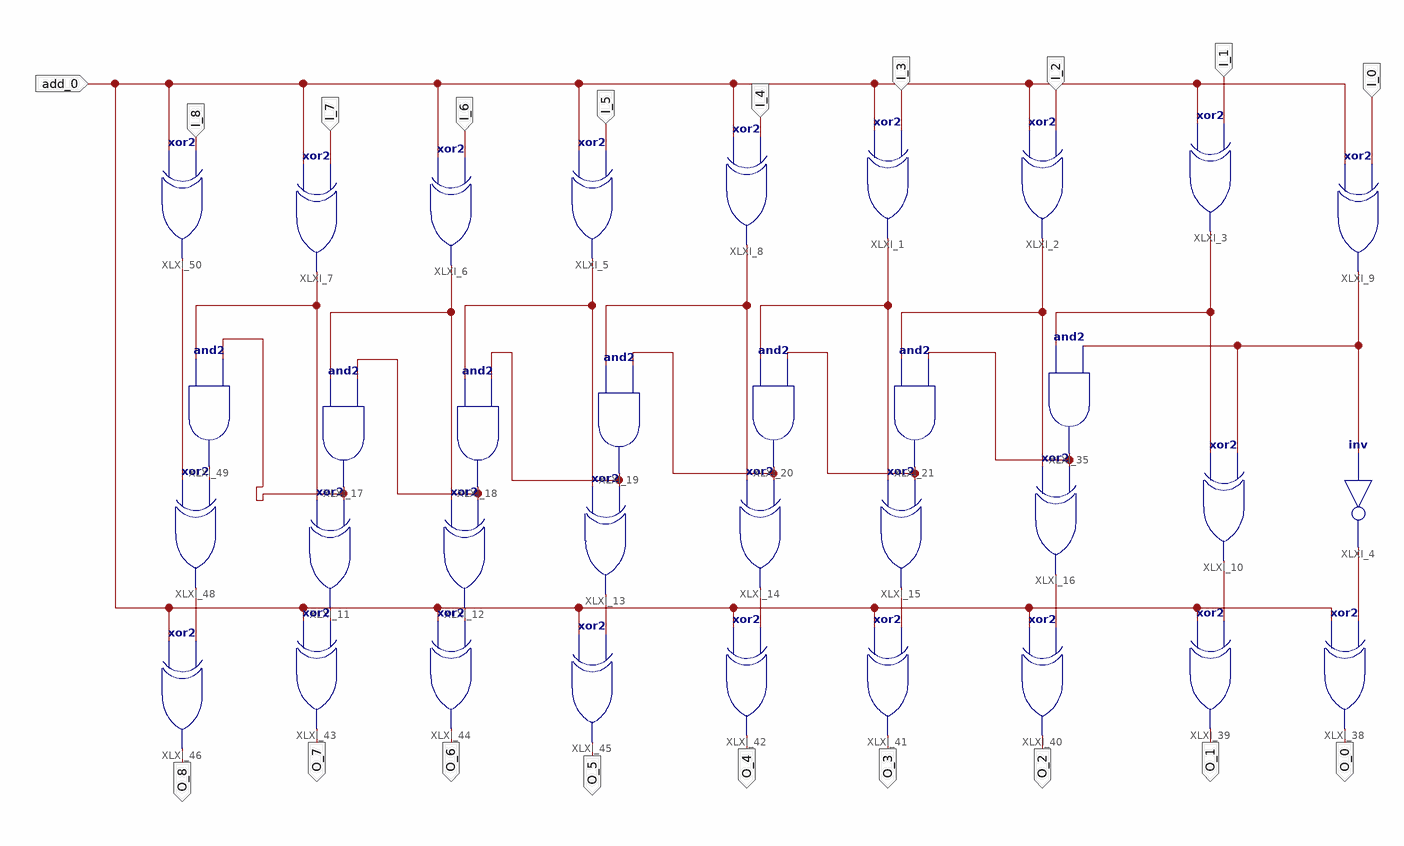
[diagram p0: schematic sheet 1]
// Xilinx ISE schematic Incrementer_Decrementer.sch (spartan3e) as structural Verilog: 34 symbols, 19 ports
module Incrementer_Decrementer (
  input  add_0,
  input  I_7,
  input  I_6,
  input  I_5,
  input  I_4,
  input  I_3,
  input  I_2,
  input  I_1,
  input  I_0,
  input  I_8,
  output O_7,
  output O_6,
  output O_5,
  output O_4,
  output O_3,
  output O_2,
  output O_1,
  output O_0,
  output O_8
);

  wire XLXN_1, XLXN_2, XLXN_3, XLXN_4, XLXN_5, XLXN_46, XLXN_47, XLXN_48, XLXN_52, XLXN_55, XLXN_57, XLXN_59,
       XLXN_62, XLXN_63, XLXN_64, XLXN_65, XLXN_66, XLXN_67, XLXN_68, XLXN_69, XLXN_70, XLXN_71, XLXN_73,
       XLXN_74, XLXN_75;

  xor XLXI_1 (XLXN_2, add_0, I_3);
  xor XLXI_2 (XLXN_3, add_0, I_2);
  xor XLXI_3 (XLXN_4, add_0, I_1);
  not XLXI_4 (XLXN_63, XLXN_52);
  xor XLXI_5 (XLXN_1, add_0, I_5);
  xor XLXI_6 (XLXN_62, add_0, I_6);
  xor XLXI_7 (XLXN_5, add_0, I_7);
  xor XLXI_8 (XLXN_59, add_0, I_4);
  xor XLXI_9 (XLXN_52, add_0, I_0);
  xor XLXI_10 (XLXN_64, XLXN_4, XLXN_52);
  xor XLXI_11 (XLXN_68, XLXN_5, XLXN_75);
  xor XLXI_12 (XLXN_69, XLXN_62, XLXN_46);
  xor XLXI_13 (XLXN_70, XLXN_1, XLXN_47);
  xor XLXI_14 (XLXN_67, XLXN_59, XLXN_48);
  xor XLXI_15 (XLXN_66, XLXN_2, XLXN_57);
  xor XLXI_16 (XLXN_65, XLXN_3, XLXN_55);
  and XLXI_17 (XLXN_75, XLXN_62, XLXN_46);
  and XLXI_18 (XLXN_46, XLXN_1, XLXN_47);
  and XLXI_19 (XLXN_47, XLXN_59, XLXN_48);
  and XLXI_20 (XLXN_48, XLXN_2, XLXN_57);
  and XLXI_21 (XLXN_57, XLXN_3, XLXN_55);
  and XLXI_35 (XLXN_55, XLXN_4, XLXN_52);
  xor XLXI_43 (O_7, add_0, XLXN_68);
  xor XLXI_44 (O_6, add_0, XLXN_69);
  xor XLXI_42 (O_4, add_0, XLXN_67);
  xor XLXI_41 (O_3, add_0, XLXN_66);
  xor XLXI_40 (O_2, add_0, XLXN_65);
  xor XLXI_39 (O_1, add_0, XLXN_64);
  xor XLXI_38 (O_0, add_0, XLXN_63);
  xor XLXI_45 (O_5, add_0, XLXN_70);
  xor XLXI_46 (O_8, add_0, XLXN_71);
  xor XLXI_48 (XLXN_71, XLXN_74, XLXN_73);
  and XLXI_49 (XLXN_73, XLXN_5, XLXN_75);
  xor XLXI_50 (XLXN_74, add_0, I_8);
endmodule
